# Altium schematic sheet Sheet1.SchDoc
size 297 x 420 mm; SheetNumber: 1; SheetTotal: 1; PageSetup: Record=PageOptions|CenterHorizontal=False|CenterVertical=False|PrintScale=0.95|XCorrection=0.00|YCorrection=0.00|PrintKind=1|BorderSize=5000000|LeftOffset=0|BottomOffset=0|Orientation=1|PaperLength=1000|PaperWidth=1000|Scale=100|PaperSource=15|PrintQuality=600|MediaType=1|DitherType=10|PaperKind=A4|PrintScaleMode=1
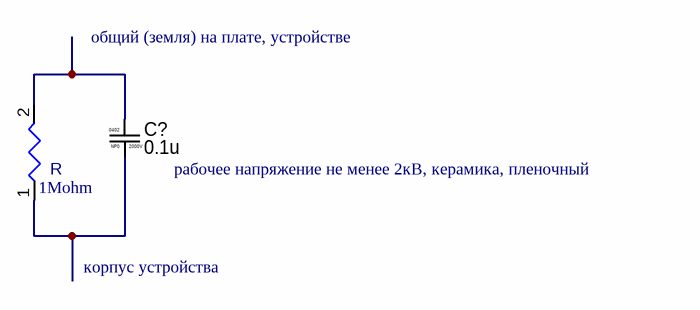
[diagram p0: Sheet1.SchDoc]

## Parts
C?  value 0.1u  Material: NP0  Limit: 2000V  Case: 0402  [CAPC1005X05N]  (hidden comment: CL05C101JB5NNNC)
R  value 1Mohm  (hidden comment: Resistors,1Mohm)

## Nets
NetC?_1: C?.1 R.2
NetC?_2: C?.2 R.1

## Notes on the sheet
- общий (земля) на плате, устройстве
- (near C?) рабочее напряжение не менее 2кВ, керамика, пленочный
- корпус устройства
- Подп. и дата
- Инв. № дубл.
- Взам. инв. №
- Инв. № подл.
- Изм
- Лист
- № докум.
- Подп.
- Дата
- Копировал
- Формат А3

## Library data of the parts
C? = CMP-001-03151-5: 100p 50V NP0 0402; Manufacturer: Samsung; Class1: Конденсатор; Class2: керамический; Name1: 0.1u 2000V NP0 0402; Name2: Конденсатор SMD, 0.1u, 2000V, NP0, 0402; Tolerance: 5%; Mounting: SMD
R = Resistors: Resistor; Component Type: Resistors